# EAGLE design Celestron Telescope GPSRX-BT-WiFi-2.0 (EAGLE 9.6.2)
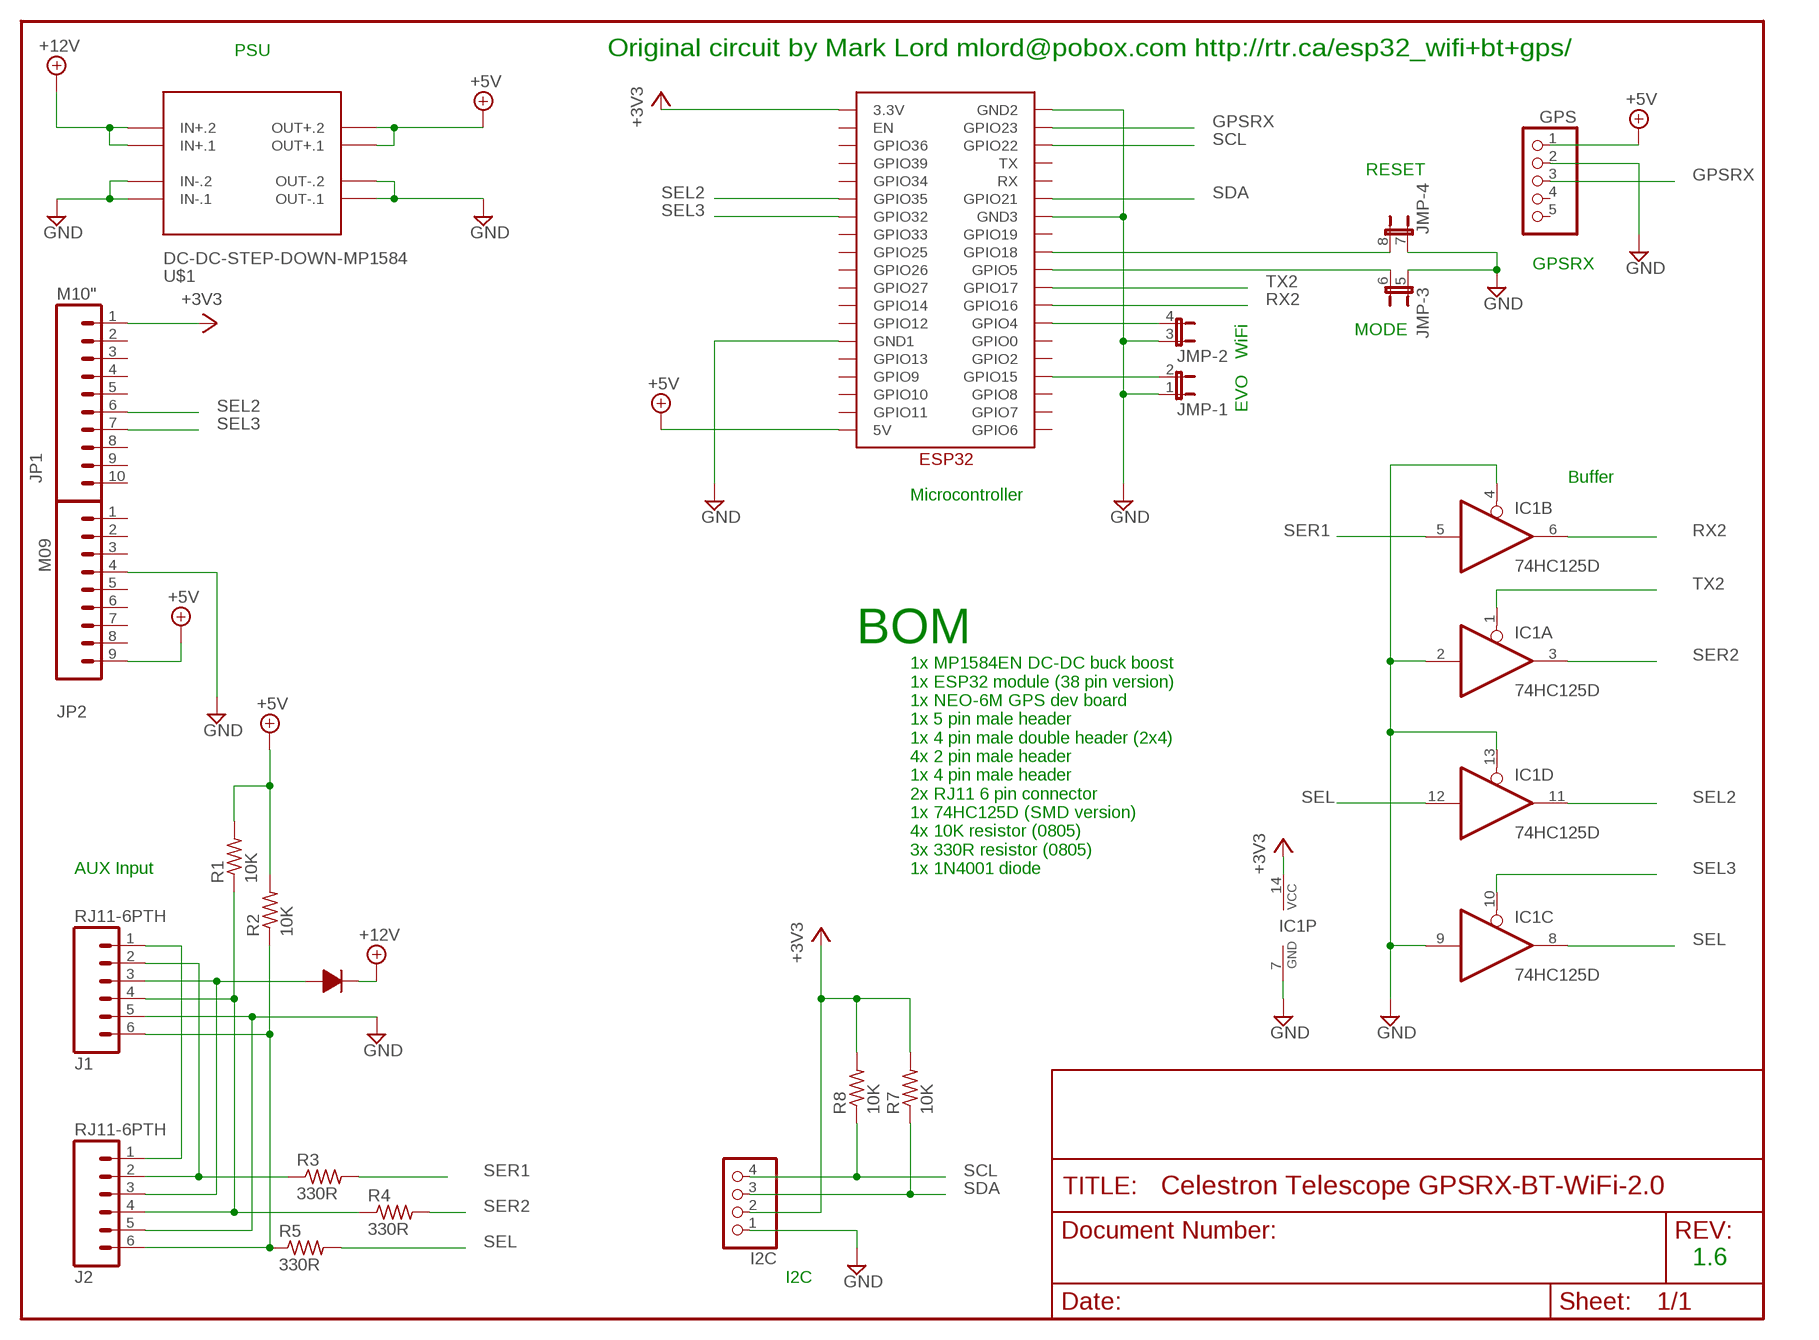
[diagram p0: schematic, sheet 1]

## Parts
GPS  PINHD-1X5  [1X05]
I2C  PINHD-1X4  [1X04]
IC1  74HC125D  [SO14]
J1  RJ11-6PTH  [RJ11-6]
J2  RJ11-6PTH  [RJ11-6]
JMP  JP4QE  [JP4Q]
JP1  M10"  [1X10]
JP2  M09  [1X09]
R1  10K  R-US_M0805  [M0805]
R2  10K  R-US_M0805  [M0805]
R3  330R  R-US_M0805  [M0805]
R4  330R  R-US_M0805  [M0805]
R5  330R  R-US_M0805  [M0805]
R7  10K  R-US_M0805  [M0805]
R8  10K  R-US_M0805  [M0805]
U$1  DC-DC-STEP-DOWN-MP1584  [DC-DC-STEP-DOWN-MP1584]
U$2  1N4001  [DIODE-12.70]
U$3  ESP32  [ESP32]

## Nets
+3V3: I2C.2 IC1.14(P:VCC) JP1.1 R7.2 R8.2 U$3.3.3V
+5V: GPS.1 JP2.9 R1.2 R2.2 U$1.OUT+.1 U$1.OUT+.2 U$3.5V
+12V: U$1.IN+.1 U$1.IN+.2 U$2.P$2
EVO: JMP.2 U$3.GPIO15
GND: GPS.2 I2C.1 IC1.2(A:I) IC1.4(B:OE) IC1.7(P:GND) IC1.9(C:I) IC1.13(D:OE) J1.5 J2.5 JMP.1 JMP.3 JMP.5 JMP.7 JP2.4 U$1.IN-.1 U$1.IN-.2 U$1.OUT-.1 U$1.OUT-.2 U$3.GND1 U$3.GND2 U$3.GND3
GPSRX: GPS.3 U$3.GPIO23
N$1: J1.6 J2.6 R2.1 R5.1
N$2: J1.3 J2.3 U$2.P$1
N$3: J1.4 J2.4 R1.1 R4.1
N$5: J1.2 J2.2 R3.1
N$6: J1.1 J2.1
N$7: JMP.4 U$3.GPIO4
N$8: JMP.6 U$3.GPIO5
N$9: JMP.8 U$3.GPIO18
RX2: IC1.6(B:O) U$3.GPIO16
SCL: I2C.4 R8.1 U$3.GPIO22
SDA: I2C.3 R7.1 U$3.GPIO21
SEL: IC1.8(C:O) IC1.12(D:I) R5.2
SEL2: IC1.11(D:O) JP1.6 U$3.GPIO35
SEL3: IC1.10(C:OE) JP1.7 U$3.GPIO32
SER1: IC1.5(B:I) R3.2
SER2: IC1.3(A:O) R4.2
TX2: IC1.1(A:OE) U$3.GPIO17
Unconnected: GPS.4 GPS.5 JP1.2 JP1.3 JP1.4 JP1.5 JP1.8 JP1.9 JP1.10 JP2.1 JP2.2 JP2.3 JP2.5 JP2.6 JP2.7 JP2.8 U$3.EN U$3.GPIO0 U$3.GPIO2 U$3.GPIO6 U$3.GPIO7 U$3.GPIO8 U$3.GPIO9 U$3.GPIO10 U$3.GPIO11 U$3.GPIO12 U$3.GPIO13 U$3.GPIO14 U$3.GPIO19 U$3.GPIO25 U$3.GPIO26 U$3.GPIO27 U$3.GPIO33 U$3.GPIO34 U$3.GPIO36 U$3.GPIO39 U$3.RX U$3.TX

## Notes on the sheet
- PSU | Original circuit by Mark Lord mlord@pobox.com http://rtr.ca/esp32_wifi+bt+gps/
- RESET
- GPSRX
- MODE
- WiFi
- EVO
- Buffer
- Microcontroller
- BOM
- AUX Input
- 1x MP1584EN DC-DC buck boost
  1x ESP32 module (38 pin version)
  1x NEO-6M GPS dev board
  1x 5 pin male header
  1x 4 pin male double header (2x4)
  4x 2 pin male header
  1x 4 pin male header
  2x RJ11 6 pin connector
  1x 74HC125D (SMD version)
  4x 10K resistor (0805)
  3x 330R resistor (0805)
  1x 1N4001 diode
- 1.6
- I2C

## Library data of the parts
GPS = pinhead:PINHD-1X5: PIN HEADER
I2C = pinhead:PINHD-1X4: PIN HEADER
IC1 = 74xx-eu:74*125: Quad bus BUFFER, 3-state
J1 J2 = SparkFun:RJ11-6: RJ11 Jack Simple 6 pin RJ11 jack. Commonly found on CAT3 devices and Microchip programmers. SKU: PRT-00132
JMP = jumper:JP4QE: JUMPER
JP1 = SparkFun:M10: Header 10 Standard 10-pin 0.1" header. Use with straight break away headers (SKU : PRT-00116), right angle break away headers (PRT-00553), swiss pins (PRT-00743), machine pins (PRT-00117), and female headers (PRT-00115).
JP2 = SparkFun:M09: Header 9 Standard 9-pin 0.1" header. Use with straight break away headers (SKU : PRT-00116), right angle break away headers (PRT-00553), swiss pins (PRT-00743), machine pins (PRT-00117), and female headers (PRT-00115).
R1-R5 R7 R8 = rcl:R-US_: RESISTOR, American symbol
U$1 = diy-modules:DC-DC-STEP-DOWN-MP1584: DC/DC Step-Down Regulator based on MP1584 chip MP1584 datasheet available here: http://www.haoyuelectronics.com/Attachment/MP1584/MP1584.pdf Click here to find device on ebay.com <http://www.ebay.com/sch/mp1584+module>
U$2 = Oles komponentbibliotek:1N4001: 1N4001 diode
U$3 = ESP32:ESP32

## Board
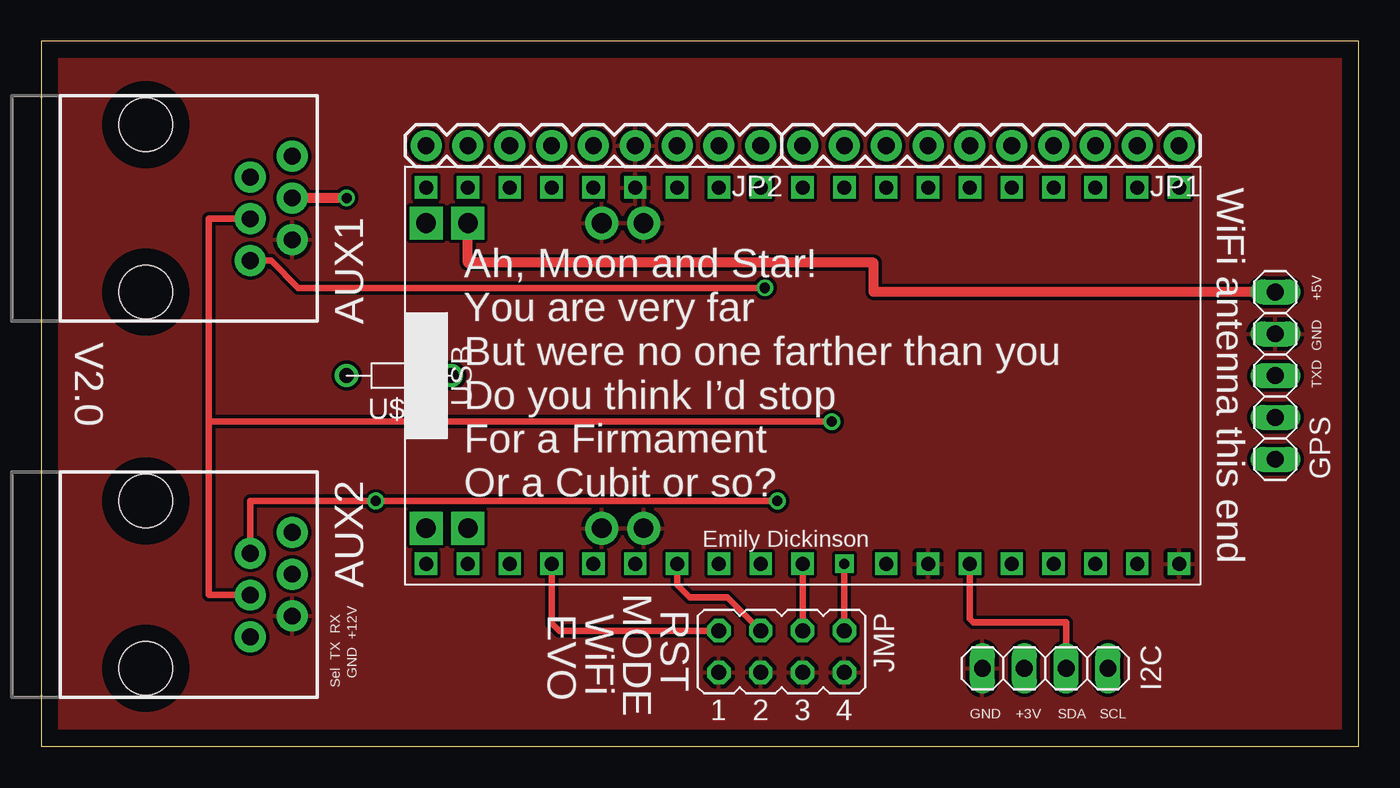
[diagram p1: board, top side]
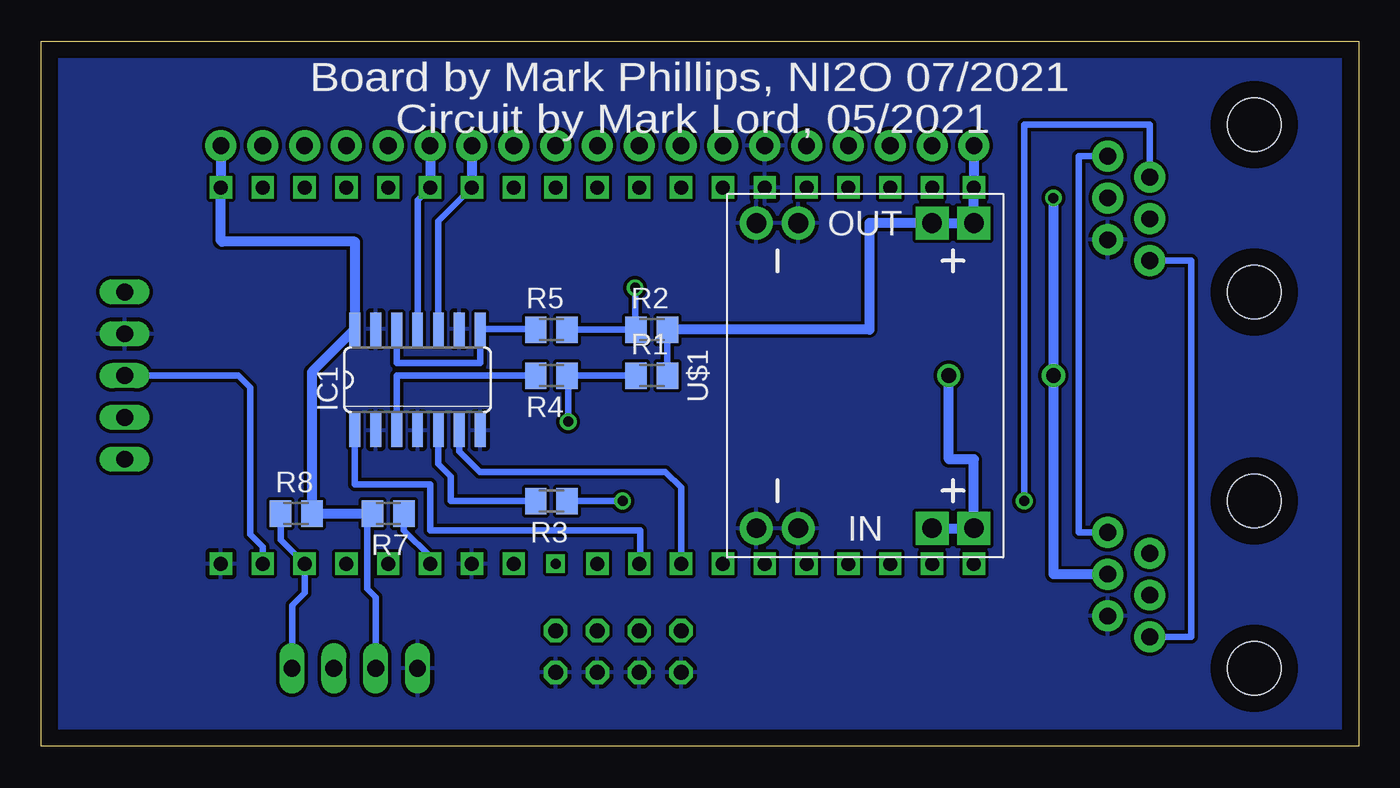
[diagram p2: board, bottom side, seen from below]

Size 80 x 42.85 mm. Coordinates in mm from the lower left corner, seen from the top.
Outline: 0,42.85 0,0 80,0 80,42.85 0,42.85
Copper layers (1*16): Top 0.035mm / dielectric 1.5mm / Bottom 0.035mm
Design rules "default": minimum track width 10mil, minimum drill 24mil, track to track 8mil, track to pad 8mil, pad to pad 8mil, via to via 8mil, smd to smd 8mil, copper to edge 40mil, drill to drill 8mil, minimum pad ring 10mil, minimum via ring 8mil, stop-mask expansion 4mil, vias tented up to drill 0mil, thermal gap 10mil

### Footprints (pad centres in the part's own frame; a part is rotated, then mirrored left to right if it is on the bottom)
1X05 = drill 1.016 long: 1 -5.08,0; 2 -2.54,0; 3 0,0; 4 2.54,0; 5 5.08,0
1X04 = drill 1.016 long: 1 -3.81,0; 2 -1.27,0; 3 1.27,0; 4 3.81,0
SO14 = smd 0.66 x 2.032: 1 -3.81,-3.073; 2 -2.54,-3.073; 3 -1.27,-3.073; 4 0,-3.073; 5 1.27,-3.073; 6 2.54,-3.073; 7 3.81,-3.073; 8 3.81,3.073; 9 2.54,3.073; 10 1.27,3.073; 11 0,3.073; 12 -1.27,3.073; 13 -2.54,3.073; 14 -3.81,3.073
RJ11-6 = drill 1.016 pad 1.88: 1 1.905,8.89; 2 3.175,6.35; 3 4.445,8.89; 4 5.715,6.35; 5 6.985,8.89; 6 8.255,6.35 | hole 3.251: 0,0; 10.16,0
JP4Q = drill 0.914 octagon: 1 -3.81,-1.27; 2 -3.81,1.27; 3 -1.27,-1.27; 4 -1.27,1.27; 5 1.27,-1.27; 6 1.27,1.27; 7 3.81,-1.27; 8 3.81,1.27
1X10 = drill 1.016 pad 1.88: 1 0,0; 2 2.54,0; 3 5.08,0; 4 7.62,0; 5 10.16,0; 6 12.7,0; 7 15.24,0; 8 17.78,0; 9 20.32,0; 10 22.86,0
1X09 = drill 1.016 pad 1.88: 1 0,0; 2 2.54,0; 3 5.08,0; 4 7.62,0; 5 10.16,0; 6 12.7,0; 7 15.24,0; 8 17.78,0; 9 20.32,0
M0805 = smd 1.3 x 1.6: 1 -0.95,0; 2 0.95,0
DC-DC-STEP-DOWN-MP1584 = drill 1.2 pad 2 square: IN+.1 -9.271,-4.064; IN+.2 -9.271,-6.604; OUT+.1 9.271,-4.064; OUT+.2 9.271,-6.604 | drill 1.2 pad 2: IN-.1 -9.271,6.604; IN-.2 -9.271,4.064; OUT-.1 9.271,6.604; OUT-.2 9.271,4.064
DIODE-12.70 = drill 0.9: P$1 -3.81,0; P$2 2.54,0
ESP32 = drill 0.85 square: 3.3V 1.27,46.99; 5V 1.27,1.27; EN 1.27,44.45; GND1 1.27,13.97; GND2 24.13,46.99; GND3 24.13,31.75; GPIO0 24.13,13.97; GPIO2 24.13,11.43; GPIO4 24.13,16.51; GPIO5 24.13,24.13; GPIO6 24.13,1.27; GPIO7 24.13,3.81; GPIO8 24.13,6.35; GPIO9 1.27,8.89; GPIO10 1.27,6.35; GPIO11 1.27,3.81; GPIO12 1.27,16.51; GPIO13 1.27,11.43; GPIO14 1.27,19.05; GPIO15 24.13,8.89; GPIO16 24.13,19.05; GPIO17 24.13,21.59; GPIO19 24.13,29.21; GPIO21 24.13,34.29; GPIO22 24.13,41.91; GPIO23 24.13,44.45; GPIO25 1.27,26.67; GPIO26 1.27,24.13; GPIO27 1.27,21.59; GPIO32 1.27,31.75; GPIO33 1.27,29.21; GPIO34 1.27,36.83; GPIO35 1.27,34.29; GPIO36 1.27,41.91; GPIO39 1.27,39.37; RX 24.13,36.83; TX 24.13,39.37 | drill 0.6 square: GPIO18 24.13,26.67

### Placement (x,y rotation side)
GPS  74.93,22.53 270 top
I2C  60.96,4.75 0 top
IC1  57.15,22.28 0 bottom
J1  6.35,14.91 270 top
J2  6.35,37.77 270 top
JMP  44.96,5.77 0 top
JP1  69.09,36.5 180 top
JP2  43.69,36.5 180 top
R1  42.93,22.53 0 bottom
R2  42.93,25.32 0 bottom
R3  49.02,14.91 180 bottom
R4  49.02,22.53 180 bottom
R5  49.02,25.32 180 bottom
R7  58.93,14.15 180 bottom
R8  64.52,14.15 0 bottom
U$1  29.97,22.53 90 bottom
U$2  22.35,22.53 0 top
U$3  22.1,35.23 270 top

### Tracks (layer width: path | path; a pad name or v marks a point on that pad's centre or on a via)
+3V3
  Bottom 0.406: I2C.2 59.69,9.07 60.2,9.58 60.2,13.83 R7.2
  Bottom 0.61: R7.2 R8.2 63.57,22.74 IC1.14 60.96,30.66 69.04,30.66 69.09,30.71 U$3.3.3V JP1.1
+5V
  Top 0.61: GPS.1 50.55,27.61 50.55,29.39 25.91,29.39 U$1.OUT+.1
  Bottom 0.406: R1.2 R2.2
  Bottom 0.61: R2.2 29.72,25.32 29.72,31.8 U$1.OUT+.1 U$1.OUT+.2 U$3.5V JP2.9
+12V
  Bottom 0.61: U$1.IN+.1 U$1.IN+.2 23.37,17.45 24.89,17.45 U$2.P$2
EVO
  Top 0.406: JMP.2 31.44,7.04 30.99,7.49 U$3.GPIO15
GND
  pour Top: 0,42.85 80.01,42.85 80.01,-0.33 0,-0.33
  pour Bottom: 0,42.85 80.01,42.85 80.01,-0.33 0,-0.33
GPSRX
  Bottom 0.406: GPS.3 68.02,22.53 67.31,21.82 67.31,12.88 66.55,12.12 U$3.GPIO23
N$1  (via drill 0.61)
  Top 0.406: J2.6 13.97,29.52 15.62,27.86 v43.94,27.86
  Bottom 0.406: J1.6 10.16,6.66 10.16,29.52 J2.6 | R5.1 R2.1 43.94,25.32 v43.94,27.86
N$2  (via drill 0.61)
  Top 0.61: v18.54,33.33 J2.3
  Bottom 0.61: J1.3 18.54,10.46 U$2.P$1 v18.54,33.33
N$3  (via drill 0.61)
  Top 0.406: J1.4 10.16,9.2 10.16,19.74 | J2.4 10.16,32.05 10.16,19.74 | v48.01,19.74 10.16,19.74
  Bottom 0.406: R4.1 48.07,22.21 | v48.01,19.74 48.01,22.53 R4.1 | R4.1 R1.1
N$5  (via drill 0.61)
  Top 0.406: J1.2 12.7,14.91 v20.32,14.91 v44.7,14.91
  Bottom 0.406: v20.32,14.91 20.32,37.77 12.7,37.77 J2.2 | R3.1 v44.7,14.91
N$6
  Bottom 0.406: J2.1 17.02,35.87 17.02,13 J1.1
N$7
  Top 0.406: JMP.4 41.66,9.07 39.37,9.07 38.61,9.83 U$3.GPIO4
N$8
  Top 0.406: 46.18,7.09 JMP.6 U$3.GPIO5
N$9
  Top 0.406: 48.72,7.04 JMP.8 U$3.GPIO18
RX2
  Bottom 0.406: IC1.6 54.61,17.93 53.37,16.69 42.11,16.69 41.15,15.72 U$3.GPIO16
SCL
  Bottom 0.406: R8.1 65.47,12.56 U$3.GPIO22 64.01,9.32 64.77,8.56 I2C.4
SDA
  Top 0.406: I2C.3 62.23,7.54 56.59,7.54 56.39,7.75 U$3.GPIO21
  Bottom 0.406: 57.86,14.15 R7.1 57.98,13.13 56.39,11.54 U$3.GPIO21
SEL
  Bottom 0.406: IC1.12 58.42,23.29 53.34,23.29 IC1.8 49.97,25.35
  Bottom 0.61: 49.97,25.35 R5.2
SEL2
  Bottom 0.406: IC1.11 57.15,33.2 U$3.GPIO35
  Bottom 0.61: JP1.6 U$3.GPIO35
SEL3
  Bottom 0.406: U$3.GPIO32 55.88,31.93 IC1.10
  Bottom 0.61: JP1.7 U$3.GPIO32
SER1
  Bottom 0.406: R3.2 55.12,14.91 55.12,16.41 55.88,17.17 IC1.5
SER2
  Bottom 0.406: R4.2 58.42,22.53 IC1.3
TX2
  Bottom 0.406: IC1.1 60.96,15.93 56.39,15.93 56.39,13.13 43.64,13.13 43.64,11.15 U$3.GPIO17

### Text on the board
tNames: WiFi antenna this end | AUX1 | +5V | V2.0 | GND | TXD | AUX2 | Ah, Moon and Star! / You are very far / But were no one farther than you / Do you think I’d stop / For a Firmament / Or a Cubit or so? | Emily Dickinson | GND +12V | MODE | Sel TX RX | EVO | WiFi | RST | GND | +3V | SDA | SCL
bNames: Board by Mark Phillips, NI2O 07/2021 | Circuit by Mark Lord, 05/2021